# EAGLE schematic adc (EAGLE 8.4.1)
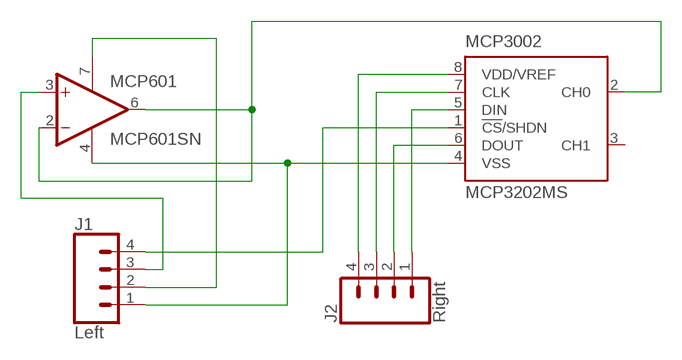
[diagram p0: schematic, sheet 1]

## Parts
J1  Left  CONN_04  [1X04]
J2  Right  CONN_04  [1X04]
MCP601  MCP601SN  [SO08]
MCP3002  MCP3202MS  [MSOP8]

## Nets
N$1: MCP601.2(-IN) MCP601.6(OUT) MCP3002.2(CH0)
N$2: J1.3 MCP601.3(+IN)
N$4: J2.4 MCP3002.8(VDD/VREF)
N$6: J2.3 MCP3002.7(CLK)
N$7: J2.2 MCP3002.6(DOUT)
N$8: J2.1 MCP3002.5(DIN)
N$9: J1.4 MCP3002.1(!CS!/SHDN)
V+: J1.2 MCP601.7(V+)
V-: J1.1 MCP601.4(V-) MCP3002.4(VSS)
Unconnected: MCP3002.3(CH1)

## Library data of the parts
J1 J2 = SparkFun-Connectors:CONN_04: Multi connection point. Often used as Generic Header-pin footprint for 0.1 inch spaced/style header connections On any of the 0.1 inch spaced packages, you can populate with these: Break Away Headers - Straight <https://www.sparkfun.com/products/116> (PRT-00116) Break Away Male Headers - Right Angle <https://www.sparkfun.com/products/553> (PRT-00553) Female Headers <https://www.sparkfun.com/products/115> (PRT-00115) Break Away Headers - Machine Pin <https://www.sparkfun.com/products/117> (PRT-00117) Break Away Female Headers - Swiss Machine Pin <https://www.sparkfun.com/products/743> (PRT-00743) For SCREWTERMINALS and SPRING TERMINALS visit here: Screw Terimnals on SparkFun.com <https://www.sparkfun.com/search/results?term=Screw+Terminals> (5mm/3.5mm/2.54mm spacing) This device is also useful as a general connection point to wire up your design to another part of your project. Our various solder wires solder well into these plated through hole pads. Hook-Up Wire - Assortment (Stranded, 22 AWG) <https://www.sparkfun.com/products/11375> (PRT-11375) Hook-Up Wire - Assortment (Solid Core, 22 AWG) <https://www.sparkfun.com/products/11367> (PRT-11367) View the entire wire category on our website here <https://www.sparkfun.com/categories/141> Special notes: Molex polarized connector foot print use with SKU : PRT-08231 with associated crimp pins and housings. 1MM SMD Version SKU: PRT-10208; PROD_ID: CONN-09696
MCP601 = linear:MCP601: Single Op Amp 2.7V to 6.0V Single Supply CMOS Source: http://ww1.microchip.com/downloads/en/DeviceDoc/21314g.pdf
MCP3002 = microchip:MCP3202: 2.7V Dual Channel 12-Bit A/D Converter with SPI Serial Interface Source: http://ww1.microchip.com/downloads/en/DeviceDoc/21034D.pdf; MF: MICROCHIP; MPN: MCP3202-CI/MS; OC_FARNELL: unknown; OC_NEWARK: 68H9370